# EAGLE design blinky_ver1 (EAGLE 9.6.2)
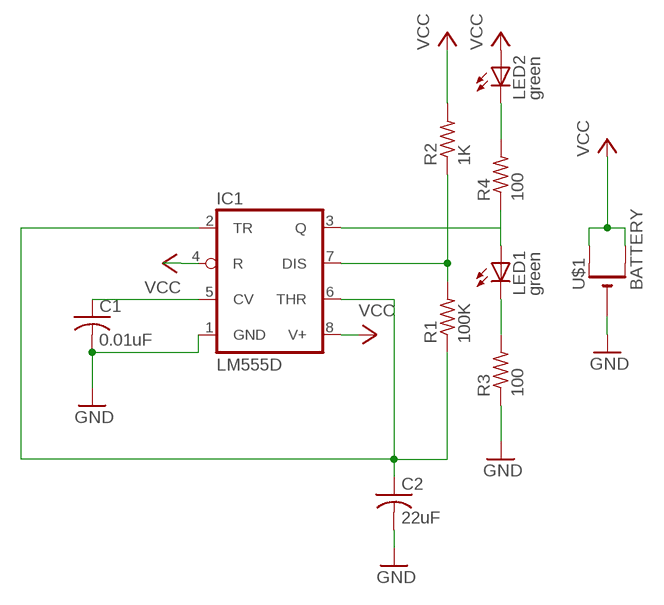
[diagram p0: schematic, sheet 1]

## Parts
C1  0.01uF  C-USC0805  [C0805]
C2  22uF  C-USC0805  [C0805]
IC1  LM555D  [SO08]
LED1  green  LEDCHIPLED_0805  [CHIPLED_0805]
LED2  green  LEDCHIPLED_0805  [CHIPLED_0805]
R1  100K  R-US_R0805  [R0805]
R2  1K  R-US_R0805  [R0805]
R3  100  R-US_R0805  [R0805]
R4  100  R-US_R0805  [R0805]
U$1  BATTERY  CR1220SMT  [CR1220-SMD]

## Nets
GND: C1.2 C2.2 IC1.1(GND) R3.1 U$1.-
N$1: LED2.C R4.2
N$2: IC1.3(Q) LED1.A R4.1
N$3: LED1.C R3.2
N$4: IC1.7(DIS) R1.2 R2.1
N$6: C1.1 IC1.5(CV)
N$7: C2.1 IC1.2(TR) IC1.6(THR) R1.1
VCC: IC1.4(R) IC1.8(V+) LED2.A R2.2 U$1.+$1(+) U$1.+$2(+1)

## Library data of the parts
C1 C2 = adafruit:C-US: CAPACITOR, American symbol
IC1 = adafruit:*555: TIMER Changed DIP package to have round (not oval) pin pads http://www.ladyada.net/library/pcb/eaglelibrary.html
LED1 LED2 = adafruit:LED: LED OSRAM: - CHIPLED LG R971, LG N971, LY N971, LG Q971, LY Q971, LO R971, LY R971 LH N974, LH R974 LS Q976, LO Q976, LY Q976 LO Q996 - Hyper CHIPLED LW Q18S LB Q993, LB Q99A, LB R99A - SideLED LS A670, LO A670, LY A670, LG A670, LP A670 LB A673, LV A673, LT A673, LW A673 LH A674 LY A675 LS A676, LA A676, LO A676, LY A676, LW A676 LS A679, LY A679, LG A679 - Hyper Micro SIDELED® LS Y876, LA Y876, LO Y876, LY Y876 LT Y87S - SmartLED LW L88C, LW L88S LB L89C, LB L89S, LG L890 LS L89K, LO L89K, LY L89K LS L896, LA L896, LO L896, LY L896 - TOPLED LS T670, LO T670, LY T670, LG T670, LP T670 LSG T670, LSP T670, LSY T670, LOP T670, LYG T670 LG T671, LOG T671, LSG T671 LB T673, LV T673, LT T673, LW T673 LH T674 LS T676, LA T676, LO T676, LY T676, LB T676, LH T676, LSB T676, LW T676 LB T67C, LV T67C, LT T67C, LS T67K, LO T67K, LY T67K, LW E67C LS E67B, LA E67B, LO E67B, LY E67B, LB E67C, LV E67C, LT E67C LW T67C LS T679, LY T679, LG T679 LS T770, LO T770, LY T770, LG T770, LP T770 LB T773, LV T773, LT T773, LW T773 LH T774 LS E675, LA E675, LY E675, LS T675 LS T776, LA T776, LO T776, LY T776, LB T776 LHGB T686 LT T68C, LB T68C - Hyper Mini TOPLED® LB M676 - Mini TOPLED Santana® LG M470 LS M47K, LO M47K, LY M47K Source: http://www.osram.convergy.de/
R1-R4 = adafruit:R-US_: RESISTOR, American symbol
U$1 = adafruit:CR1220: CR1216/CR1220/CR1225 12mm 3V lithium coin cell Great for battery packup. Both SMT and THM holders. Note the THM package has the ground pads on both sides of the PCB so that the masks are the same - this reduces the cost

## Net classes
0 default: width 0.305 mm, drill 0.508 mm, clearance 0.254 mm

## Board
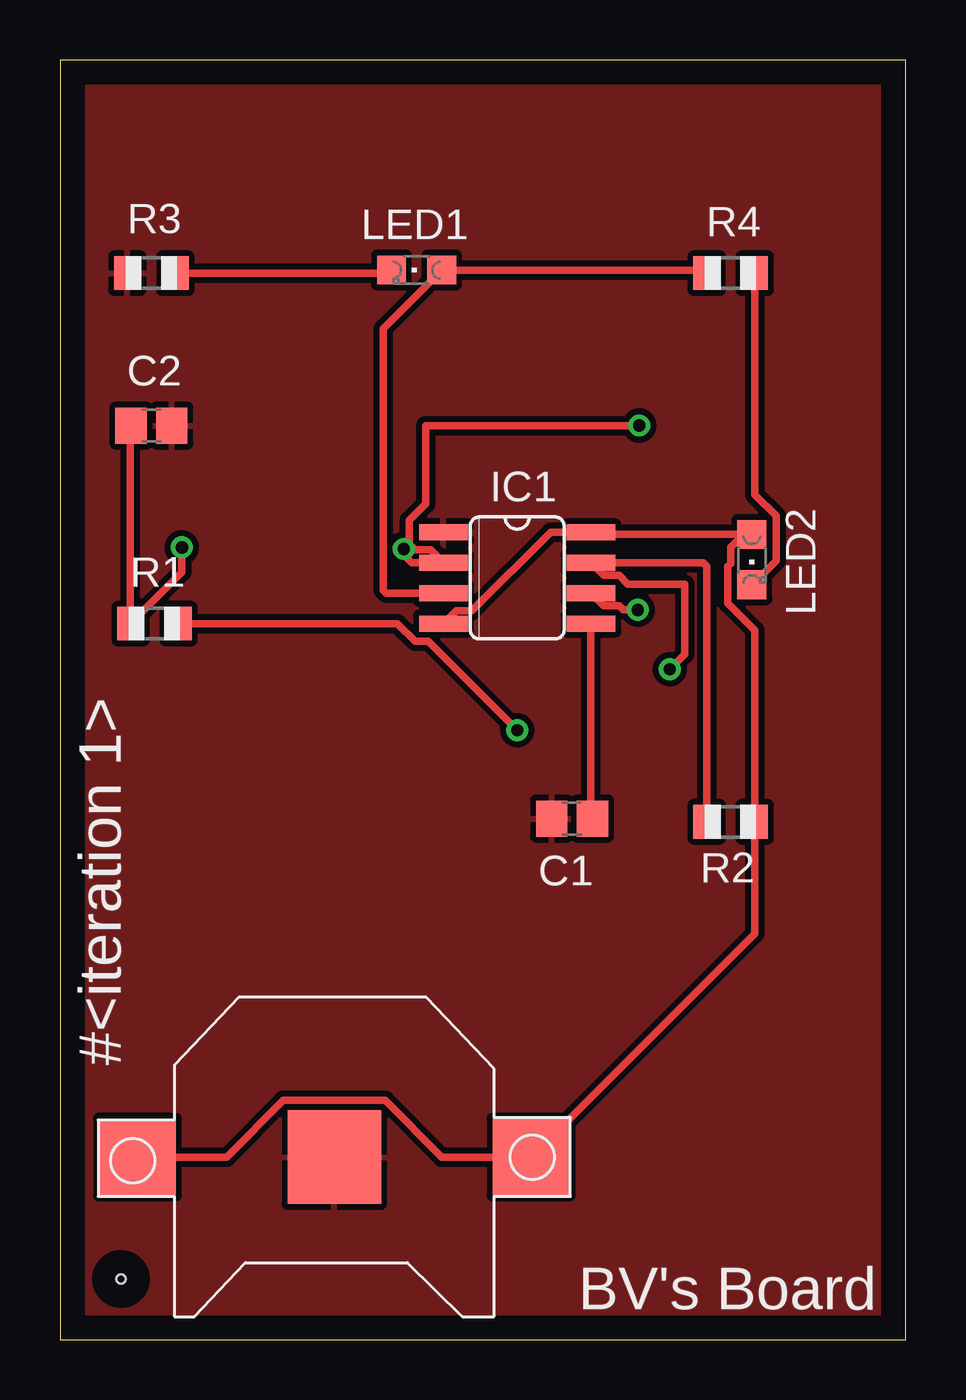
[diagram p1: board, top side]
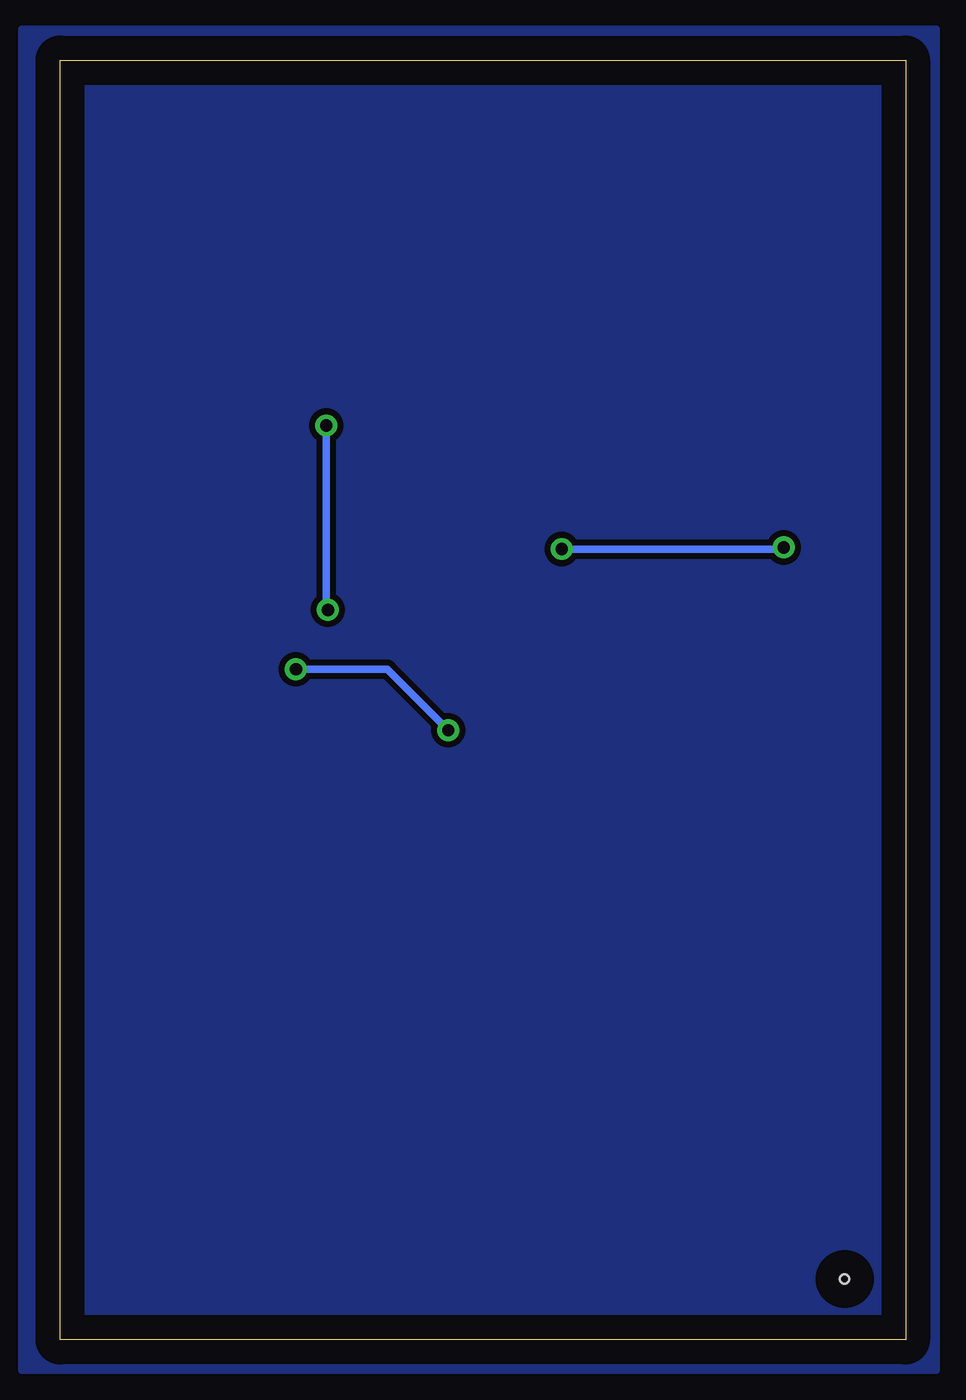
[diagram p2: board, bottom side, seen from below]

Size 35.23 x 53.33 mm. Coordinates in mm from the lower left corner, seen from the top.
Outline: 0,0 35.23,0 35.23,53.33 0,53.33 0,0
Copper layers (1*16): Top 0.035mm / dielectric 1.5mm / Bottom 0.035mm
Design rules "default": minimum track width 6mil, minimum drill 0.35mm, track to track 6mil, track to pad 6mil, pad to pad 6mil, via to via 6mil, smd to smd 6mil, copper to edge 40mil, drill to drill 6mil, minimum pad ring 10mil, minimum via ring 8mil, stop-mask expansion 4mil, vias tented up to drill 0mil, thermal gap 10mil
Holes 0.38 mm at 2.54,2.54

### Footprints (pad centres in the part's own frame; a part is rotated, then mirrored left to right if it is on the bottom)
C0805 = smd 1.3 x 1.5: 1 -0.85,0; 2 0.85,0
SO08 = smd 0.66 x 2.032: 1 -1.905,-3.073; 2 -0.635,-3.073; 3 0.635,-3.073; 4 1.905,-3.073; 5 1.905,3.073; 6 0.635,3.073; 7 -0.635,3.073; 8 -1.905,3.073
CHIPLED_0805 = smd 1.2 x 1.2: A 0,-1.05; C 0,1.05
R0805 = smd 1.1 x 1.4: 1 -1,0; 2 1,0
CR1220-SMD = smd 3.2 x 3.2: +$1 -8.2,0; +$2 8.2,0 | smd 3.9 x 3.9: - 0,0

### Placement (x,y rotation side)
C1  21.34,21.72 180 top
C2  3.81,38.1 0 top
IC1  19.05,31.75 270 top
LED1  14.86,44.58 90 top
LED2  28.83,32.51 180 top
R1  3.94,29.84 0 top
R2  27.94,21.59 0 top
R3  3.81,44.45 0 top
R4  27.94,44.45 0 top
U$1  11.43,7.62 180 top

### Tracks (layer width: path | path; a pad name or v marks a point on that pad's centre or on a via)
BOTTOM
  pour Bottom: -1.27,54.61 36.83,54.61 36.83,-1.27 -1.27,-1.27
GND
  pour Top: -1.27,-1.27 36.83,-1.27 36.83,54.61 -1.27,54.61
N$1
  Top 0.305: R4.2 28.94,35.23 29.84,34.33 29.84,32.47 LED2.C
N$2
  Top 0.305: R4.1 26.81,44.58 LED1.A 13.46,42.13 13.46,31.24 13.59,31.11 IC1.3
N$3
  Top 0.305: R3.2 13.68,44.45 LED1.C
N$4  (via drill 0.51)
  Top 0.305: R2.1 26.94,32.24 26.8,32.38 IC1.7 22.66,31.85 23.31,31.85 23.66,31.5 26.04,31.5 26.04,28.57 v25.4,27.94 | v19.05,25.4 15.34,29.11 14.79,29.11 14.06,29.84 R1.2
  Bottom 0.305: v19.05,25.4 21.59,27.94 v25.4,27.94
N$6
  Top 0.305: IC1.5 22.12,21.78 C1.1
N$7  (via drill 0.51)
  Top 0.305: C2.1 2.94,38.08 R1.1 5.08,31.99 v5.08,33.02 | v24.13,38.1 15.24,38.1 15.24,34.84 14.55,34.15 14.55,33.16 14.79,32.92 15.44,32.92 IC1.2 14.66,32.38 14.02,33.02 14.26,33.02 v14.33,32.95 | v24.07,30.42 23.47,30.42 23.31,30.58 22.66,30.58 IC1.6
  Bottom 0.305: v24.13,38.1 24.13,30.61 24,30.48 v24.07,30.42 | v14.33,32.95 5.15,32.95 v5.08,33.02
VCC
  Top 0.305: U$1.+$2 6.96,7.62 9.31,9.98 13.55,9.98 15.9,7.62 U$1.+$1 28.94,16.93 R2.2 28.94,29.58 27.82,30.69 27.82,32.23 27.94,32.35 27.94,33.02 28.48,33.56 LED2.A 22.22,33.56 IC1.8 20.44,33.66 17.16,30.38 16.51,30.38 IC1.4

### Text on the board
tPlace: #<iteration 1> | BV's Board